# Altium schematic sheet SMPSBreakout.SchDoc
size A; SheetNumber: 1; SheetTotal: 1
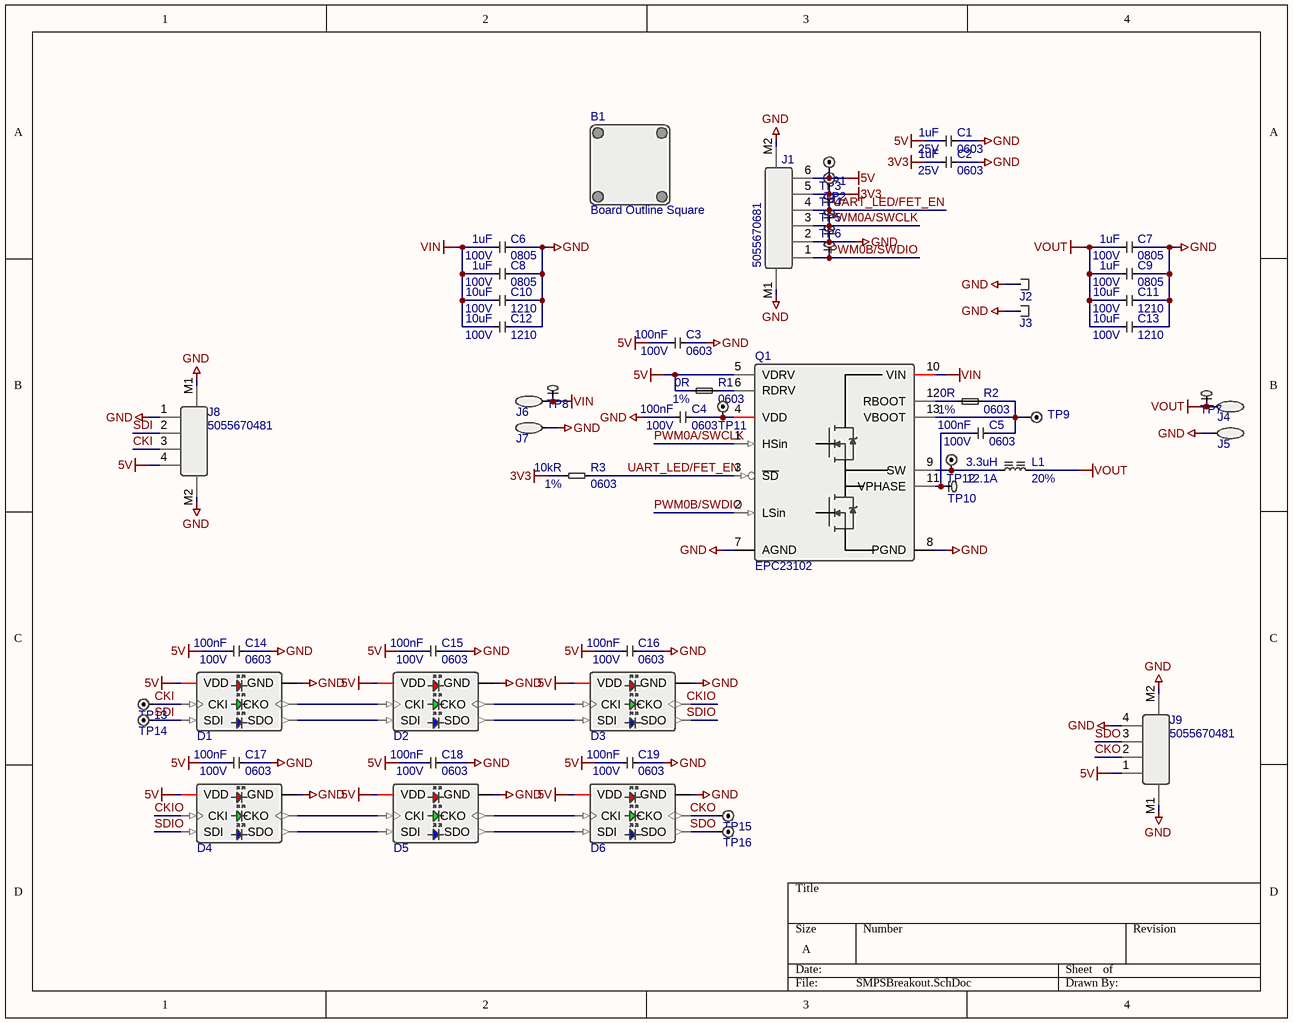
[diagram p0: SMPSBreakout.SchDoc]

## Parts
B1  Board Outline Square  [PCB_OUTLINE_SQUARE]
C1  value 1uF  Voltage - Rated: 25V  Package/Case Imperial: 0603  [CAPACITOR_0603(1608)_GENERIC]  (hidden comment: Capacitor - Ceramic - Generic)
C2  value 1uF  Voltage - Rated: 25V  Package/Case Imperial: 0603  [CAPACITOR_0603(1608)_GENERIC]  (hidden comment: Capacitor - Ceramic - Generic)
C3  value 100nF  Voltage - Rated: 100V  Package/Case Imperial: 0603  [CAPACITOR_0603(1608)_GENERIC]  (hidden comment: Capacitor - Ceramic - Generic)
C4  value 100nF  Voltage - Rated: 100V  Package/Case Imperial: 0603  [CAPACITOR_0603(1608)_GENERIC]  (hidden comment: Capacitor - Ceramic - Generic)
C5  value 100nF  Voltage - Rated: 100V  Package/Case Imperial: 0603  [CAPACITOR_0603(1608)_GENERIC]  (hidden comment: Capacitor - Ceramic - Generic)
C6  value 1uF  Voltage - Rated: 100V  Package/Case Imperial: 0805  [CAPACITOR_0805(2012)_GENERIC]  (hidden comment: Capacitor - Ceramic - Generic)
C7  value 1uF  Voltage - Rated: 100V  Package/Case Imperial: 0805  [CAPACITOR_0805(2012)_GENERIC]  (hidden comment: Capacitor - Ceramic - Generic)
C8  value 1uF  Voltage - Rated: 100V  Package/Case Imperial: 0805  [CAPACITOR_0805(2012)_GENERIC]  (hidden comment: Capacitor - Ceramic - Generic)
C9  value 1uF  Voltage - Rated: 100V  Package/Case Imperial: 0805  [CAPACITOR_0805(2012)_GENERIC]  (hidden comment: Capacitor - Ceramic - Generic)
C10  value 10uF  Voltage - Rated: 100V  Package/Case Imperial: 1210  [CAPACITOR_1210(3225)_GENERIC]  (hidden comment: Capacitor - Ceramic - Generic)
C11  value 10uF  Voltage - Rated: 100V  Package/Case Imperial: 1210  [CAPACITOR_1210(3225)_GENERIC]  (hidden comment: Capacitor - Ceramic - Generic)
C12  value 10uF  Voltage - Rated: 100V  Package/Case Imperial: 1210  [CAPACITOR_1210(3225)_GENERIC]  (hidden comment: Capacitor - Ceramic - Generic)
C13  value 10uF  Voltage - Rated: 100V  Package/Case Imperial: 1210  [CAPACITOR_1210(3225)_GENERIC]  (hidden comment: Capacitor - Ceramic - Generic)
C14  value 100nF  Voltage - Rated: 100V  Package/Case Imperial: 0603  [CAPACITOR_0603(1608)_GENERIC]  (hidden comment: Capacitor - Ceramic - Generic)
C15  value 100nF  Voltage - Rated: 100V  Package/Case Imperial: 0603  [CAPACITOR_0603(1608)_GENERIC]  (hidden comment: Capacitor - Ceramic - Generic)
C16  value 100nF  Voltage - Rated: 100V  Package/Case Imperial: 0603  [CAPACITOR_0603(1608)_GENERIC]  (hidden comment: Capacitor - Ceramic - Generic)
C17  value 100nF  Voltage - Rated: 100V  Package/Case Imperial: 0603  [CAPACITOR_0603(1608)_GENERIC]  (hidden comment: Capacitor - Ceramic - Generic)
C18  value 100nF  Voltage - Rated: 100V  Package/Case Imperial: 0603  [CAPACITOR_0603(1608)_GENERIC]  (hidden comment: Capacitor - Ceramic - Generic)
C19  value 100nF  Voltage - Rated: 100V  Package/Case Imperial: 0603  [CAPACITOR_0603(1608)_GENERIC]  (hidden comment: Capacitor - Ceramic - Generic)
D1  APA102C  [5X5MM(6PIN)_JLEAD_GENERIC]  (value not drawn)
D2  APA102C  [5X5MM(6PIN)_JLEAD_GENERIC]  (value not drawn)
D3  APA102C  [5X5MM(6PIN)_JLEAD_GENERIC]  (value not drawn)
D4  APA102C  [5X5MM(6PIN)_JLEAD_GENERIC]  (value not drawn)
D5  APA102C  [5X5MM(6PIN)_JLEAD_GENERIC]  (value not drawn)
D6  APA102C  [5X5MM(6PIN)_JLEAD_GENERIC]  (value not drawn)
J1  Manufacturer Part Number 1: 5055670681  [CONNECTOR_HEADER_MOLEX_5055670681]  (hidden comment: Connector - Header - 6P 2M - Generic)
J2  PP45 Staple  [CONNECTOR_ACCESSORY_PP45-STAPLE_ANDERSON]  (value not drawn)
J3  PP45 Staple  [CONNECTOR_ACCESSORY_PP45-STAPLE_ANDERSON]  (value not drawn)
J4  PP45  [CONNECTOR_BTOC_PP45_ANDERSON]  (value not drawn)
J5  PP45  [CONNECTOR_BTOC_PP45_ANDERSON]  (value not drawn)
J6  PP45  [CONNECTOR_BTOC_PP45_ANDERSON]  (value not drawn)
J7  PP45  [CONNECTOR_BTOC_PP45_ANDERSON]  (value not drawn)
J8  Manufacturer Part Number 1: 5055670481  [CONNECTOR_HEADER_MOLEX_5055670481]  (hidden comment: Connector - Header - 4P 2M - Generic)
J9  Manufacturer Part Number 1: 5055670481  [CONNECTOR_HEADER_MOLEX_5055670481]  (hidden comment: Connector - Header - 4P 2M - Generic)
L1  value 3.3uH  Tolerance: 20%  Current - Rating: 12.1A  [XGL6060_COILCRAFT]  (hidden comment: Inductor - Ferrite Core - Generic)
Q1  EPC23102  [QFN-13_EPC_EPC2310X]
R1  value 0R  Tolerance: 1%  Package/Case Imperial: 0603  [RESISTOR_0603(1608)_NC_JUMPER]  (hidden comment: Resistor - Fixed - Jumper)  (net tie, no BOM)
R2  value 0R  Tolerance: 1%  Package/Case Imperial: 0603  [RESISTOR_0603(1608)_NC_JUMPER]  (hidden comment: Resistor - Fixed - Jumper)  (net tie, no BOM)
R3  value 10kR  Tolerance: 1%  Package/Case Imperial: 0603  [RESISTOR_0603(1608)_GENERIC]  (hidden comment: Resistor - Fixed - Generic)
TP1  Test Point - THT  [TESTPOINT_THT_OCTAGON]  (value not drawn)
TP2  Test Point - THT  [TESTPOINT_THT_OCTAGON]  (value not drawn)
TP3  519XTR  [TESTPOINT_LOOP_SMD_KEYSTONE_519X]  (value not drawn)
TP4  519XTR  [TESTPOINT_LOOP_SMD_KEYSTONE_519X]  (value not drawn)
TP5  519XTR  [TESTPOINT_LOOP_SMD_KEYSTONE_519X]  (value not drawn)
TP6  519XTR  [TESTPOINT_LOOP_SMD_KEYSTONE_519X]  (value not drawn)
TP7  519XTR  [TESTPOINT_LOOP_SMD_KEYSTONE_519X]  (value not drawn)
TP8  519XTR  [TESTPOINT_LOOP_SMD_KEYSTONE_519X]  (value not drawn)
TP9  Test Point - THT  [TESTPOINT_THT_OCTAGON]  (value not drawn)
TP10  519XTR  [TESTPOINT_LOOP_SMD_KEYSTONE_519X]  (value not drawn)
TP11  Test Point - THT  [TESTPOINT_THT_OCTAGON]  (value not drawn)
TP12  Test Point - THT  [TESTPOINT_THT_OCTAGON]  (value not drawn)
TP13  Test Point - THT  [TESTPOINT_THT_OCTAGON]  (value not drawn)
TP14  Test Point - THT  [TESTPOINT_THT_OCTAGON]  (value not drawn)
TP15  Test Point - THT  [TESTPOINT_THT_OCTAGON]  (value not drawn)
TP16  Test Point - THT  [TESTPOINT_THT_OCTAGON]  (value not drawn)

## Nets
3V3: C2.1 J1.5 R3.1 TP2.1
5V: C1.1 C3.1 C14.1 C15.1 C16.1 C17.1 C18.1 C19.1 D1.4(VDD) D2.4(VDD) D3.4(VDD) D4.4(VDD) D5.4(VDD) D6.4(VDD) J1.6 J8.4 J9.1 Q1.5(VDRV) R1.1 TP1.1
GND: C1.2 C2.2 C3.2 C4.1 C6.2 C7.2 C8.2 C9.2 C10.2 C11.2 C12.2 C13.2 C14.2 C15.2 C16.2 C17.2 C18.2 C19.2 D1.3(GND) D2.3(GND) D3.3(GND) D4.3(GND) D5.3(GND) D6.3(GND) J1.2 J1.M1 J1.M2 J2.1 J3.1 J5.1 J7.1 J8.1 J8.M1 J8.M2 J9.4 J9.M1 J9.M2 Q1.7(AGND) Q1.8(PGND) TP5.1
VIN: C6.1 C8.1 C10.1 C12.1 J6.1 Q1.10(VIN) TP8.1
VOUT: C7.1 C9.1 C11.1 C13.1 J4.1 L1.2 TP7.1
CKI: D1.2(CKI) J8.3 TP13.1
CKIO: D3.5(CKO) D4.2(CKI)
CKO: D6.5(CKO) J9.2 TP15.1
PWM0A/SWCLK: J1.3 Q1.1(HSin) TP4.1
PWM0B/SWDIO: J1.1 Q1.2(LSin) TP6.1
SDI: D1.1(SDI) J8.2 TP14.1
SDIO: D3.6(SDO) D4.1(SDI)
SDO: D6.6(SDO) J9.3 TP16.1
UART_LED/FET_EN: J1.4 Q1.3(~{SD}) R3.2 TP3.1
NetC4_2: C4.2 Q1.4(VDD) TP11.1
NetC5_1: C5.1 Q1.11(VPHASE) TP10.1
NetC5_2: C5.2 Q1.13(VBOOT) R2.2 TP9.1
NetD1_5: D1.5(CKO) D2.2(CKI)
NetD1_6: D1.6(SDO) D2.1(SDI)
NetD2_5: D2.5(CKO) D3.2(CKI)
NetD2_6: D2.6(SDO) D3.1(SDI)
NetD4_5: D4.5(CKO) D5.2(CKI)
NetD4_6: D4.6(SDO) D5.1(SDI)
NetD5_5: D5.5(CKO) D6.2(CKI)
NetD5_6: D5.6(SDO) D6.1(SDI)
NetL1_1: L1.1 Q1.9(SW) TP12.1
NetQ1_6: Q1.6(RDRV) R1.2
NetQ1_12: Q1.12(RBOOT) R2.1

## Library data of the parts
B1 = Board_Outline_Square
C1 C2 = CAP-CER_1UF_25V_20%_X7R_0603(1608): 1uF ±20% 25V Ceramic Capacitor X7R 0603(1608 Metric); Manufacturer 1: Murata Electronics; Manufacturer Part Number 1: GCM188R71E105KA64D; Manufacturer Lifecycle 1: Active; Package/Case Metric: 1608; Name: CAP-CER_1UF_25V_20%_X7R_0603(1608); Item: CAP-CER; Temperature Coefficient: X7R; Tolerance: 20%; Mounting Type: SMT; Full Item: Ceramic Capacitor; Manufacturer 2: Murata Electronics; Manufacturer Part Number 2: GCM188R71E105KA64J; Manufacturer Lifecycle 2: Active; Manufacturer 3: Murata Electronics; Manufacturer Part Number 3: GCM188R71E105MA64D; Manufacturer Lifecycle 3: Active
C3-C5 C14-C19 = CAP-CER_100NF_100V_20%_X7R_0603(1608): 100nF ±20% 100V Ceramic Capacitor X7R 0603(1608 Metric); Manufacturer 1: Murata Electronics; Manufacturer Part Number 1: GRM188R72A104KA35D; Manufacturer Lifecycle 1: Active; Package/Case Metric: 1608; Name: CAP-CER_100NF_100V_20%_X7R_0603(1608); Item: CAP-CER; Temperature Coefficient: X7R; Tolerance: 20%; Mounting Type: SMT; Full Item: Ceramic Capacitor; Manufacturer 2: Murata Electronics; Manufacturer Part Number 2: GRM188R72A104KA35J; Manufacturer Lifecycle 2: Active; Manufacturer 3: Murata Electronics; Manufacturer Part Number 3: GRM188R72A104MA35D; Manufacturer Lifecycle 3: Active
C6-C9 = CAP-CER_1UF_100V_10%_X7S_0805(2012): 1uF ±10% 100V Ceramic Capacitor X7S 0805(2012 Metric); Manufacturer 1: Murata Electronics; Manufacturer Part Number 1: GRM21BC72A105KE01L; Manufacturer Lifecycle 1: Active; Package/Case Metric: 2012; Name: CAP-CER_1UF_100V_10%_X7S_0805(2012); Item: CAP-CER; Temperature Coefficient: X7S; Tolerance: 10%; Mounting Type: SMT; Full Item: Ceramic Capacitor; Manufacturer 2: Murata Electronics; Manufacturer Part Number 2: GRJ21BC72A105KE11L; Manufacturer Lifecycle 2: Active; Manufacturer 3: Murata Electronics; Manufacturer Part Number 3: GRM21BC72A105KE01K; Manufacturer Lifecycle 3: Active
C10-C13 = CAP-CER_10UF_100V_20%_X7S_1210(3225): 10uF ±20% 100V Ceramic Capacitor X7S 1210(3225 Metric); Manufacturer 1: Murata Electronics; Manufacturer Part Number 1: GRM32EC72A106ME05L; Manufacturer Lifecycle 1: Active; Package/Case Metric: 3225; Name: CAP-CER_10UF_100V_20%_X7S_1210(3225); Item: CAP-CER; Temperature Coefficient: X7S; Tolerance: 20%; Mounting Type: SMT; Full Item: Ceramic Capacitor; Manufacturer 2: Murata Electronics; Manufacturer Part Number 2: GRM32EC72A106KE05L; Manufacturer Lifecycle 2: Active; Manufacturer 3: Murata Electronics; Manufacturer Part Number 3: GRM32EC72A106KE05K; Manufacturer Lifecycle 3: Active
D1-D6 = Diode - LED - Addressable - 5x5mm APA102C: Supplier 1: Digi-Key; Supplier Part Number 1: 1568-COM-16345-ND; Supplier 2: Mouser; Supplier Part Number 2: 474-COM-16345
J1 = CON_HDR_6P_1.25MM-PITCH_50V_2.4A_SMT_MOLEX_5055670681: Connector Header 6 Pin 1.25mm Pitch Mating 50V 2.4A Rated 8 Walls Shrouded SMT Molex 5055670681; Manufacturer Lifecycle 1: Active; Number of Positions: 6; Shrouding: 8 Walls; Name: CON_HDR_6P_1.25MM-PITCH_50V_2.4A_SMT_MOLEX_5055670681; Item: CON_HDR; Pitch - Mating: 1.25mm; Fastening Type: Locking Ramp; Voltage - Max: 50V; Current - Max: 2.4A; Mounting Type: SMT; Full Item: Connector Header; Manufacturer 1: Molex
J2 J3 = Connector - Accessory - Mechanical Support - Anderson PP45 Staple
J4-J7 = Connector - Modular - 1P - Anderson PP45
J8 J9 = CON_HDR_4P_1.25MM-PITCH_50V_2.4A_SMT_MOLEX_5055670481: Connector Header 4 Pin 1.25mm Pitch Mating 50V 2.4A Rated 6 Walls Shrouded SMT Molex 5055670481; Manufacturer Lifecycle 1: Active; Number of Positions: 4; Shrouding: 6 Walls; Name: CON_HDR_4P_1.25MM-PITCH_50V_2.4A_SMT_MOLEX_5055670481; Item: CON_HDR; Pitch - Mating: 1.25mm; Fastening Type: Locking Ramp; Voltage - Max: 50V; Current - Max: 2.4A; Mounting Type: SMT; Full Item: Connector Header; Manufacturer 1: Molex
L1 = IND-FXD_3.3UH_20%_5.9MR_13.4A_NONSTANDARD: Fixed Inductor 3.3uH 20% 5.9mR 12.1A Rated 13.4A Saturation Nonstandard 6.71mmx6.71mm; Manufacturer 1: Coilcraft; Manufacturer Part Number 1: XGL6060-332MEC; Manufacturer Lifecycle 1: Active; Type: Molded; Name: IND-FXD_3.3UH_20%_5.9MR_13.4A_NONSTANDARD; Item: IND-FXD; Package/Case Standard: Nonstandard; Package/Case Manufacturer: 6.71mmx6.71mm; DCR: 5.9mR; Current - Saturation: 13.4A; Mounting Type: SMT; Full Item: Fixed Inductor
Q1 = MOSFET - GaN - Integrated Driver EPC 23102: Supplier 1: Digi-Key; Supplier Part Number 1: 917-EPC23102ENGRTCT-ND; Supplier 2: Digi-Key; Supplier Part Number 2: 917-EPC23102ENGRTDKR-ND
R1 R2 = RES-JMP_0R_1%_100MW_100PPM/°C_0603(1608): 0R ±1% 100mW Chip Resistor with Jumper 100ppm/°C 0603(1608 Metric); Package/Case Metric: 1608; Name: RES-JMP_0R_1%_100MW_100PPM/°C_0603(1608); Item: RES-JMP; Temperature Coefficient: 100ppm/°C; Power: 100mW; Mounting Type: SMT; Full Item: Chip Resistor with Jumper
R3 = RES-FXD_10KR_1%_100MW_100PPM/°C_0603(1608): 10kR ±1% 100mW Chip Resistor 100ppm/°C 0603(1608 Metric); Manufacturer 1: Bourns Inc.; Manufacturer Part Number 1: CR0603-FX-1002ELF; Manufacturer Lifecycle 1: Active; Package/Case Metric: 1608; Name: RES-FXD_10KR_1%_100MW_100PPM/°C_0603(1608); Item: RES-FXD; Temperature Coefficient: 100ppm/°C; Power: 100mW; Mounting Type: SMT; Full Item: Chip Resistor; Manufacturer 2: Bourns Inc.; Manufacturer Part Number 2: CR0603AFX-1002EAS; Manufacturer Lifecycle 2: Active; Manufacturer 3: Bourns Inc.; Manufacturer Part Number 3: CMP0603-FX-1002ELF; Manufacturer Lifecycle 3: Active
TP3-TP8 TP10 = Test Point - SMT - Loop - Keystone 519X